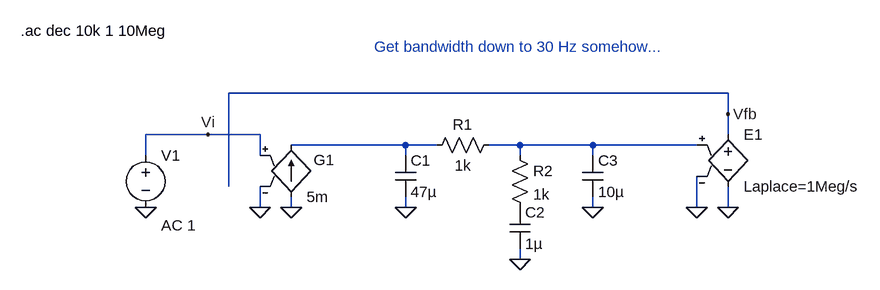
[diagram p0: schematic IF_PLL_ChargePumpFilter.asc]
IF_PLL_ChargePumpFilter.asc, the LTspice schematic file:
Version 4.1
SHEET 1 920 680
WIRE 704 176 -64 176
WIRE 704 208 704 176
WIRE -96 240 -192 240
WIRE -16 240 -96 240
WIRE 704 240 704 208
WIRE 208 256 32 256
WIRE 256 256 208 256
WIRE 384 256 336 256
WIRE 496 256 384 256
WIRE 656 256 496 256
WIRE -192 272 -192 240
WIRE -16 272 -16 240
WIRE 208 272 208 256
WIRE 384 272 384 256
WIRE 496 272 496 256
WIRE -64 320 -64 176
WIRE -16 352 -16 320
WIRE 32 352 32 336
WIRE 208 352 208 336
WIRE 496 352 496 336
WIRE 656 352 656 304
WIRE 704 352 704 320
WIRE 384 432 384 416
FLAG -16 352 0
FLAG -192 352 0
FLAG 32 352 0
FLAG 208 352 0
FLAG 384 432 0
FLAG 496 352 0
FLAG -96 240 Vi
FLAG 656 352 0
FLAG 704 352 0
FLAG 704 208 Vfb
SYMBOL voltage -192 256 R0
WINDOW 123 24 124 Left 2
WINDOW 39 0 0 Left 0
SYMATTR InstName V1
SYMATTR Value ""
SYMATTR Value2 AC 1
SYMBOL g 32 240 R0
WINDOW 0 35 39 Left 2
SYMATTR InstName G1
SYMATTR Value 5m
SYMBOL cap 192 272 R0
SYMATTR InstName C1
SYMATTR Value 47µ
SYMBOL res 352 240 R90
WINDOW 0 0 56 VBottom 2
WINDOW 3 32 56 VTop 2
SYMATTR InstName R1
SYMATTR Value 1k
SYMBOL res 368 256 R0
SYMATTR InstName R2
SYMATTR Value 1k
SYMBOL cap 368 352 R0
SYMATTR InstName C2
SYMATTR Value 1µ
SYMBOL cap 480 272 R0
SYMATTR InstName C3
SYMATTR Value 10µ
SYMBOL e 704 224 R0
SYMATTR InstName E1
SYMATTR Value Laplace=1Meg/s
TEXT -384 80 Left 2 !.ac dec 10k 1 10Meg
TEXT 160 104 Left 2 ;Get bandwidth down to 30 Hz somehow...

The netlist it stands for:
* IF_PLL_ChargePumpFilter.asc
V1 Vi 0 AC 1
G1 0 N001 Vi 0 5m
C1 N001 0 47µ
R1 N002 N001 1k
R2 N002 P001 1k
C2 P001 0 1µ
C3 N002 0 10µ
E1 Vfb 0 N002 0 Laplace=1Meg/s
.ac dec 10k 1 10Meg
* Get bandwidth down to 30 Hz somehow...
.backanno
.end